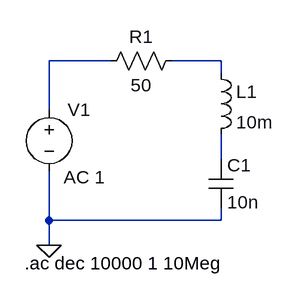
[diagram p0: schematic Circuito7.asc]
Circuito7.asc, the LTspice schematic file:
Version 4
SHEET 1 880 680
WIRE 64 80 -16 80
WIRE 208 80 144 80
WIRE 208 96 208 80
WIRE -16 144 -16 80
WIRE 208 208 208 176
WIRE -16 288 -16 224
WIRE 208 288 208 272
WIRE 208 288 -16 288
WIRE -16 320 -16 288
FLAG -16 320 0
SYMBOL voltage -16 128 R0
WINDOW 123 19 104 Left 2
WINDOW 39 0 0 Left 0
SYMATTR InstName V1
SYMATTR Value ""
SYMATTR Value2 AC 1
SYMBOL res 160 64 R90
WINDOW 0 0 56 VBottom 2
WINDOW 3 32 56 VTop 2
SYMATTR InstName R1
SYMATTR Value 50
SYMBOL ind 192 80 R0
SYMATTR InstName L1
SYMATTR Value 10m
SYMBOL cap 192 208 R0
SYMATTR InstName C1
SYMATTR Value 10n
TEXT -48 344 Left 2 !.ac dec 10000 1 10Meg

The netlist it stands for:
* Circuito7.asc
V1 N001 0 AC 1
R1 N002 N001 50
L1 N002 N003 10m
C1 N003 0 10n
.ac dec 10000 1 10Meg
.backanno
.end